# Altium schematic sheet VT 8S LHS Bot V0.1.SchDoc
size A4; SheetNumber: 1; SheetTotal: 1
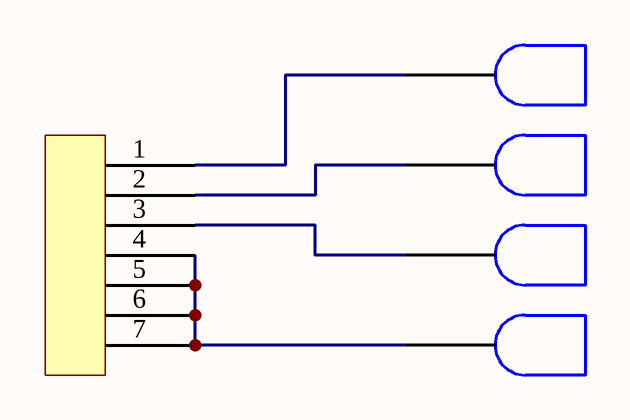
[diagram p0: VT 8S LHS Bot V0.1.SchDoc]

## Parts
J7  Voltage Tap  [Voltage Tap]  (value not drawn)  (no BOM)
J8  Voltage Tap  [Voltage Tap]  (value not drawn)  (no BOM)
J9  Voltage Tap  [Voltage Tap]  (value not drawn)  (no BOM)
J10  84953-7-FPC  [84953-7 - FPC]  (value not drawn)  (no BOM)
J11  Voltage Tap  [Voltage Tap]  (value not drawn)  (no BOM)

## Nets
NetJ7_1: J7.1 J10.1
NetJ8_1: J8.1 J10.2
NetJ9_1: J9.1 J10.3
NetJ10_4: J10.4 J10.5 J10.6 J10.7 J11.1

## Library data of the parts
J10 = 84953-7-FPC: FPC Connectors, Flex-to-Board, 7 Position, .039 in [1 mm] Centerline, FPC Side Connector